# EAGLE design Test FRAM (EAGLE 9.6.2)
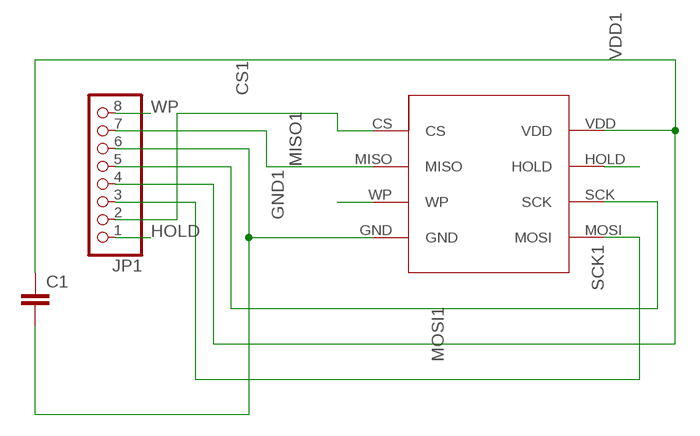
[diagram p0: schematic, sheet 1]

## Parts
C1  C-EU025-040X050  [C025-040X050]
JP1  PINHD-1X8  [1X08]
U$1  MB85RS  [SOIC8]

## Nets
CS1: JP1.2 U$1.CS
GND1: C1.2 JP1.6 U$1.GND
HOLD: JP1.1 U$1.HOLD
MISO1: JP1.7 U$1.MISO
MOSI1: JP1.3 U$1.MOSI
SCK1: JP1.5 U$1.SCK
VDD1: C1.1 JP1.4 U$1.VDD
WP: JP1.8 U$1.WP

## Library data of the parts
C1 = rcl:C-EU: CAPACITOR, European symbol; SPICEPREFIX: C
JP1 = pinhead:PINHD-1X8: PIN HEADER
U$1 = MB85RS:MB85RS

## Net classes
0 default: clearance 0.255 mm

## Board
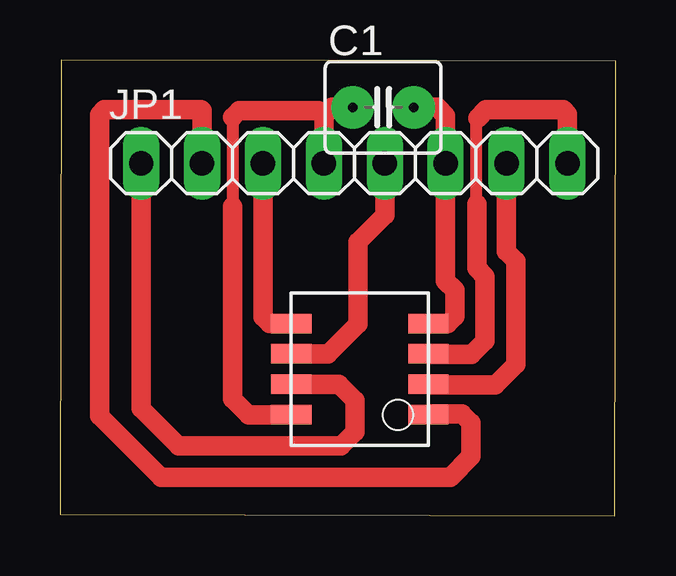
[diagram p1: board, top side]

Size 23.18 x 19 mm. Coordinates in mm from the lower left corner, seen from the top.
Outline: 0,0.05 23.14,0 23.18,18.95 0.04,19 0,0.05
Copper layers (1*16): Top 0.035mm / dielectric 1.5mm / Bottom 0.035mm
Design rules "Test FRAM": minimum track width 6mil, minimum drill 0.35mm, track to track 0.255mm, track to pad 0.255mm, pad to pad 0.255mm, via to via 0.255mm, smd to smd 6mil, copper to edge 40mil, drill to drill 6mil, minimum pad ring 10mil, minimum via ring 8mil, stop-mask expansion 4mil, vias tented up to drill 0mil, thermal gap 10mil

### Footprints (pad centres in the part's own frame; a part is rotated, then mirrored left to right if it is on the bottom)
C025-040X050 = drill 0.4 pad 1.778: 1 -1.27,0; 2 1.27,0
1X08 = drill 1.016 long: 1 -8.89,0; 2 -6.35,0; 3 -3.81,0; 4 -1.27,0; 5 1.27,0; 6 3.81,0; 7 6.35,0; 8 8.89,0
SOIC8 = smd 1.676 x 0.813: CS -2.54,-1.27; GND -2.54,-5.08; HOLD 3.175,-2.54; MISO -2.54,-2.54; MOSI 3.175,-5.08; SCK 3.175,-3.81; VDD 3.175,-1.27; WP -2.54,-3.81

### Placement (x,y rotation side)
C1  13.48,17.03 0 top
JP1  12.27,14.69 0 top
U$1  12.82,2.93 180 top

### Tracks (layer width: path | path; a pad name or v marks a point on that pad's centre or on a via)
CS1
  Top 0.813: JP1.2 5.92,16.89 5.89,16.92 1.84,16.92 1.65,16.73 1.65,4.17 4.22,1.59 16.27,1.59 17.14,2.47 17.14,3.86 16.76,4.24 15.4,4.24 U$1.CS
GND1
  Top 0.813: U$1.GND 16.18,8.01 16.47,8.3 16.47,9.4 16.08,9.79 JP1.6 16.08,16.68 15.74,17.03 C1.2
HOLD
  Top 0.813: JP1.1 3.38,4.47 4.95,2.9 11.71,2.9 12.3,3.49 12.3,4.81 11.64,5.47 U$1.HOLD
MISO1
  Top 0.813: JP1.7 18.62,11.02 19.02,10.62 19.02,6.31 18.16,5.46 15.38,5.46 U$1.MISO
MOSI1
  Top 0.813: JP1.3 8.46,8.29 8.74,8.01 U$1.MOSI
SCK1
  Top 0.813: U$1.SCK 11.18,6.74 12.42,7.99 12.42,11.41 13.54,12.53 JP1.5
VDD1
  Top 0.5: 7.2,16.62 7.2,12.89
  Top 0.508: 7.2,12.89
  Top 0.61: 11,16.68 10.79,16.89
  Top 0.813: JP1.4 11,16.68 11.35,17.03 C1.1 | 10.79,16.89 7.47,16.89 7.2,16.62 | U$1.VDD 7.87,4.2 7.2,4.87 7.2,12.89
WP
  Top 0.48: 17.35,12.96 17.39,13
  Top 0.5: 17.35,16.51 17.35,12.96
  Top 0.508: 17.42,16.58 17.35,16.51
  Top 0.813: JP1.8 21.16,16.75 20.99,16.92 17.77,16.92 17.42,16.58 | 17.39,13 17.39,10.31 17.72,9.98 17.72,7.28 17.17,6.72 15.38,6.72 U$1.WP